# EAGLE design esp-01-programmer (EAGLE 8.5.1)
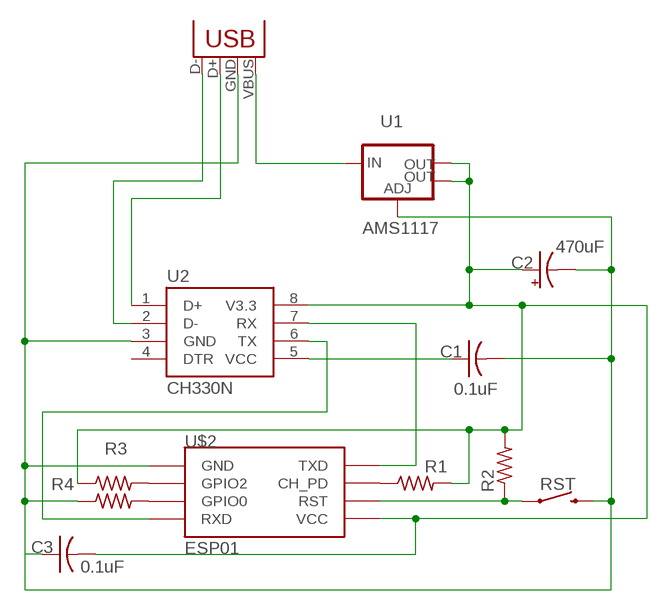
[diagram p0: schematic, sheet 1]

## Parts
C1  0.1uF  C-USC1206  [C1206]
C2  470uF  CPOL-USE2.5-6  [E2,5-6]
C3  0.1uF  C-USC1206  [C1206]
R1  R-US_R1206  [R1206]
R2  R-US_R1206  [R1206]
R3  R-US_R1206  [R1206]
R4  R-US_R1206  [R1206]
RST  MOMENTARY-SWITCH-SPST-PTH-6.0MM  [TACTILE_SWITCH_PTH_6.0MM]
U1  AMS1117  V_REG_LM1117SOT223  [SOT223]
U2  CH330N  [SOIC8]
U$2  ESP01  [ESP01]
USB-A  USB-A-H  [USB-A-H]

## Nets
3.3V: C2.+ C3.2 R1.2 R2.2 R3.1 U1.2(OUT) U1.4(OUT) U2.8(V3.3) U$2.VCC
D+: U2.1(D+) USB-A.D+(D-)
D-: U2.2(D-) USB-A.D-(D+)
GND: C1.2 C2.- C3.1 R4.1 RST.3 U1.1(ADJ) U2.3(GND) U$2.GND USB-A.GND(VBUS)
N$1: R2.1 RST.1 U$2.RST
N$2: R4.2 U$2.GPIO0
N$3: R3.2 U$2.GPIO2
N$9: C1.1 U2.5(VCC)
N$10: U2.7(RX) U$2.TX(TXD)
N$11: U2.6(TX) U$2.RX(RXD)
N$12: R1.1 U$2.CH_PD
VUSB: U1.3(IN) USB-A.VBUS(GND)

## Power pins joined to a net without a drawn wire
DTR: U2.4(DTR)

## Library data of the parts
C1 C3 = adafruit:C-US: CAPACITOR, American symbol
C2 = adafruit:CPOL-US: POLARIZED CAPACITOR, American symbol
R1-R4 = adafruit:R-US_: RESISTOR, American symbol
RST = SparkFun-Switches:MOMENTARY-SWITCH-SPST: Momentary Switch (Pushbutton) - SPST Normally-open (NO) SPST momentary switches (buttons, pushbuttons). Variants PTH-12MM - 12mm square, through-hole Momentary Pushbutton Switch - 12mm Square <https://www.sparkfun.com/products/9190> (COM-09190) PTH-6.0MM, PTH-6.0MM-KIT - 6.0mm square, through-hole Mini Pushbutton Switch <https://www.sparkfun.com/products/97> (COM-00097) KIT package intended for soldering kit's - only one side of pads' copper is exposed. PTH-RIGHT-ANGLE-KIT - Right-angle, through-hole Right Angle Tactile Button <https://www.sparkfun.com/products/10791> - Used on SparkFun BigTime Watch Kit <https://www.sparkfun.com/products/11734> SMD-12MM - 12mm square, surface-mount Tactile Button - SMD (12mm) <https://www.sparkfun.com/products/12993> (COM-12993) Used on SparkFun PicoBoard <https://www.sparkfun.com/products/11888> SMD-4.5MM - 4.5mm Square Trackball Switch Used on SparkFun Blackberry Trackballer Breakout <https://www.sparkfun.com/products/13169> SMD-4.6MMX2.8MM - 4.60mm x 2.80mm, surface mount Used on SparkFun SAMD21 Mini Breakout <https://www.sparkfun.com/products/13664> SMD-5.2MM, SMD-5.2-REDUNDANT - 5.2mm square, surface-mount Mini Pushbutton Switch - SMD <https://www.sparkfun.com/products/8720> (COM-08720) Used on Arduino Pro Mini <https://www.sparkfun.com/products/11114> REDUNDANT package connects both switch circuits together SMD-6.0X3.5MM - 6.0 x 3.5mm, surface mount Momentary Reset Switch SMD <https://www.sparkfun.com/products/8229> (COM-08229) SMD-6.2MM-TALL - 6.2mm square, surface mount Tactile Button - SMD (6mm) <https://www.sparkfun.com/products/12992> Used on SparkFun Digital Sandbox <https://www.sparkfun.com/products/12651> SMD-RIGHT-ANGLE - Right-angle, surface mount Used on SparkFun Block for Intel® Edison - Arduino <https://www.sparkfun.com/products/13036>; PROD_ID: SWCH-08441; SF_SKU: COM-00097
U1 = SparkFun-IC-Power:V_REG_LM1117: Voltage Regulator LM1117 Standard adjustable voltage regulator but in SMD form. Spark Fun Electronics SKU : COM-00595; PROD_ID: VREG-08170
U2 = ch330n:CH330N
U$2 = esp8266:ESP01: ESP8266 Wifi module 01
USB-A = usb:USB: USB Connectors USB-B-PTH is fully proven SKU : PRT-00139 USB-miniB is fully proven SKU : PRT-00587 USB-A-PCB is untested. USB-A-H is throughly reviewed, but untested. Spark Fun Electronics SKU : PRT-00437 USB-B-SMT is throughly reviewed, but untested. Needs silkscreen touching up. USB-A-S has not been used/tested USB-MB-H has not been used/tested

## Board
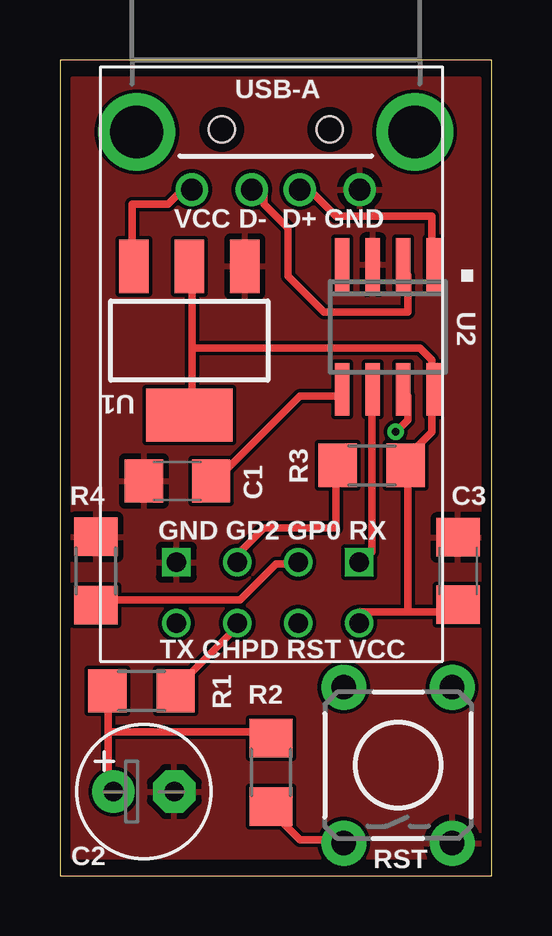
[diagram p1: board, top side]
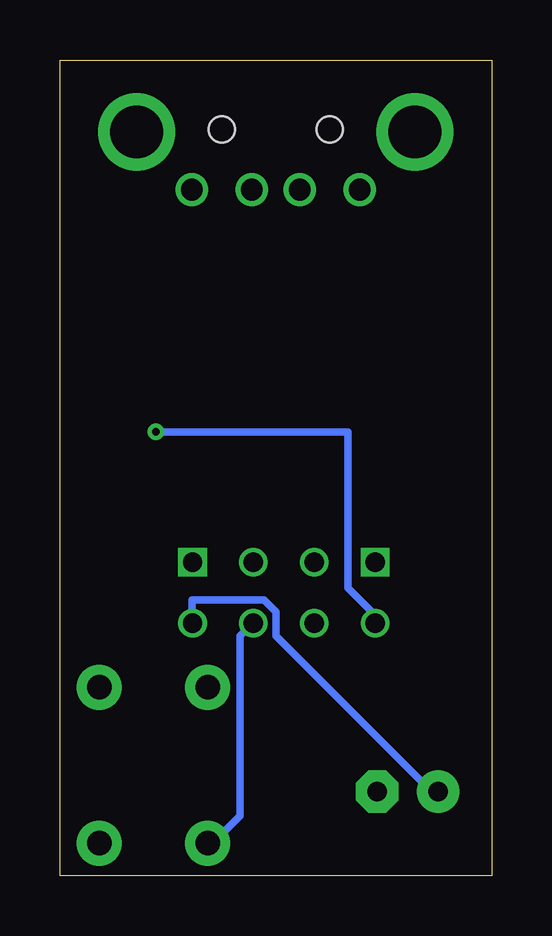
[diagram p2: board, bottom side, seen from below]

Size 18 x 34 mm. Coordinates in mm from the lower left corner, seen from the top.
Outline: 0,0 18,0 18,34 0,34 0,0
Copper layers (1*16): Top 0.0356mm / dielectric 1.5011mm / Bottom 0.0356mm
Design rules "PCBs_io *": minimum track width 12mil, minimum drill 13mil, track to track 6mil, track to pad 6mil, pad to pad 6mil, via to via 6mil, smd to smd 6mil, copper to edge 15mil, drill to drill 6mil, minimum pad ring 7mil, minimum via ring 7mil, stop-mask expansion 3mil, vias tented up to drill 0mil, thermal gap 10mil

### Footprints (pad centres in the part's own frame; a part is rotated, then mirrored left to right if it is on the bottom)
C1206 = smd 1.6 x 1.8: 1 -1.4,0; 2 1.4,0
E2,5-6 = drill 0.813 pad 1.778: + -1.27,0 | drill 0.813 pad 1.778 octagon: - 1.27,0
R1206 = smd 1.6 x 1.803: 1 -1.422,0; 2 1.422,0
TACTILE_SWITCH_PTH_6.0MM = drill 1.016 pad 1.88: 1 -3.251,2.261; 2 3.251,2.261; 3 -3.251,-2.261; 4 3.251,-2.261
SOT223 = smd 1.219 x 2.235: 1 -2.311,-3.099; 2 0,-3.099; 3 2.311,-3.099 | smd 3.6 x 2.2: 4 0,3.099
SOIC8 = smd 0.6 x 2.2: 1 -1.905,-2.6; 2 -0.635,-2.6; 3 0.635,-2.6; 4 1.905,-2.6; 5 1.905,2.6; 6 0.635,2.6; 7 -0.635,2.6; 8 -1.905,2.6
ESP01 = drill 0.8: CH_PD -1.285,-8.178; GPIO0 1.255,-5.638; GPIO2 -1.285,-5.638; RST 1.255,-8.178; TX -3.825,-8.178; VCC 3.795,-8.178 | drill 0.8 square: GND -3.825,-5.638; RX 3.795,-5.638
USB-A-H = drill 0.914: D+ 2.4,1; D- 2.4,-1; GND 2.4,3.5; VBUS 2.4,-3.5 | drill 2.2: GND@1 0,5.8; GND@2 0,-5.8 | hole 1.1: -0.1,2.25; -0.1,-2.25

### Placement (x,y rotation side)
C1  4.9,16.45 180 top
C2  3.5,3.5 0 top
C3  16.6,12.7 270 top
R1  3.4,7.7 180 top
R2  8.8,4.3 90 top
R3  13,17.1 180 top
R4  1.5,12.7 270 top
RST  14.1,4.6 90 top
U1  5.4,22.3 180 top
U2  13.68,22.87 180 top
U$2  8.68,18.7 0 top
USB-A  9,31 270 top

### Tracks (layer width: path | path; a pad name or v marks a point on that pad's centre or on a via)
3.3V
  Top 0.305: 2,6 2,3.5 C2.+ | 2,6 2,7.5 R1.2 | 2,6 8.5,6 R2.2 | 5.5,22 5.5,19.5 U1.4 | 5.5,22 5.5,25 U1.2 | 14.5,11 12.5,11 U$2.VCC | 14.5,11 16.5,11 C3.2 | 14.5,11 14.5,17 R3.1 14.5,17.5 15.5,18.5 15.5,20 U2.8 15.5,20.5 15.5,21.5 15,22 5.5,22
  Bottom 0.305: C2.+ 2.5,3.5 9,10 9,11 9.5,11.5 12.5,11.5 12.5,11 U$2.VCC
D+
  Top 0.305: U2.1 15.5,25.5 15.5,27.5 11.5,27.5 10.5,28.5 10,28.5 USB-A.D+
D-
  Top 0.305: U2.2 14.5,25 14.5,23.5 11,23.5 9.5,25 9.5,27 8.5,28 8.5,28.5 8,28.5 USB-A.D-
GND
  pour Top: 0.75,33.25 17.5,33.25 17.5,0.75 0.5,0.75 0.5,33.25
N$1
  Top 0.305: R2.1 9,2.5 10,1.5 11.5,1.5 RST.1
  Bottom 0.305: U$2.RST 10,10.5 10.5,10 10.5,2.5 11.5,1.5 RST.1
N$2
  Top 0.305: R4.2 1.5,11.5 7.5,11.5 9,13 9.5,13 U$2.GPIO0
N$3
  Top 0.305: R3.2 11.5,17 11.5,14.5 8.5,14.5 7.5,13.5 U$2.GPIO2
N$9
  Top 0.305: C1.1 6.5,16.5 10,20 11.5,20 U2.5
N$10  (via drill 0.33)
  Top 0.305: v14,18.5 14.5,19 14.5,20 U2.7
  Bottom 0.305: v14,18.5 6,18.5 6,12 5,11 U$2.TX
N$11
  Top 0.305: U2.6 13,20 13,13.5 12.5,13.5 U$2.RX
N$12
  Top 0.305: R1.1 5,8 7.5,10.5 U$2.CH_PD
VUSB
  Top 0.305: U1.3 3,25.5 3,28 4.5,28 5,28.5 5.5,28.5 USB-A.VBUS

### Text on the board
tNames: VCC D- D+ GND | . | GND GP2 GP0 RX | TX CHPD RST VCC